# EAGLE design SupportESP8266 (EAGLE 7.5.0)
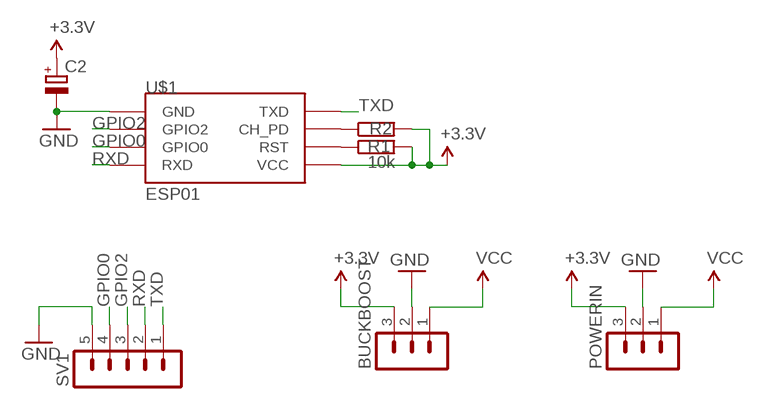
[diagram p0: schematic, sheet 1]

## Parts
BUCKBOOST  MA03-1  [MA03-1]
C2  CPOL-EUE5-10.5  [E5-10,5]
POWERIN  MA03-1  [MA03-1]
R1  10k  R-EU_0204/7  [0204/7]
R2  R-EU_0204/7  [0204/7]
SV1  MA05-1  [MA05-1]
U$1  ESP01  [ESP01]

## Nets
+3.3V [POWER]: BUCKBOOST.3 C2.+ POWERIN.3 R1.2 R2.2 U$1.VCC
+3V [POWER]: BUCKBOOST.1 POWERIN.1 ; supply symbol labelled VCC
GND [POWER]: BUCKBOOST.2 C2.- POWERIN.2 SV1.5 U$1.GND
GPIO0: SV1.4 U$1.GPIO0
GPIO2: SV1.3 U$1.GPIO2
N$1: R1.1 U$1.RST
N$2: R2.1 U$1.CH_PD
RXD: SV1.2 U$1.RX(RXD)
TXD: SV1.1 U$1.TX(TXD)

## Library data of the parts
BUCKBOOST POWERIN = con-lstb:MA03-1: PIN HEADER; OC_FARNELL: unknown; OC_NEWARK: unknown
C2 = rcl:CPOL-EU: POLARIZED CAPACITOR, European symbol
R1 R2 = rcl:R-EU_: RESISTOR, European symbol
SV1 = con-lstb:MA05-1: PIN HEADER; OC_FARNELL: unknown; OC_NEWARK: unknown
U$1 = esp8266modules:ESP01: ESP8266 Wifi module 01

## Net classes
0 default: width 0.305 mm, clearance 0.254 mm
1 POWER: width 0.508 mm, clearance 0.305 mm

## Board
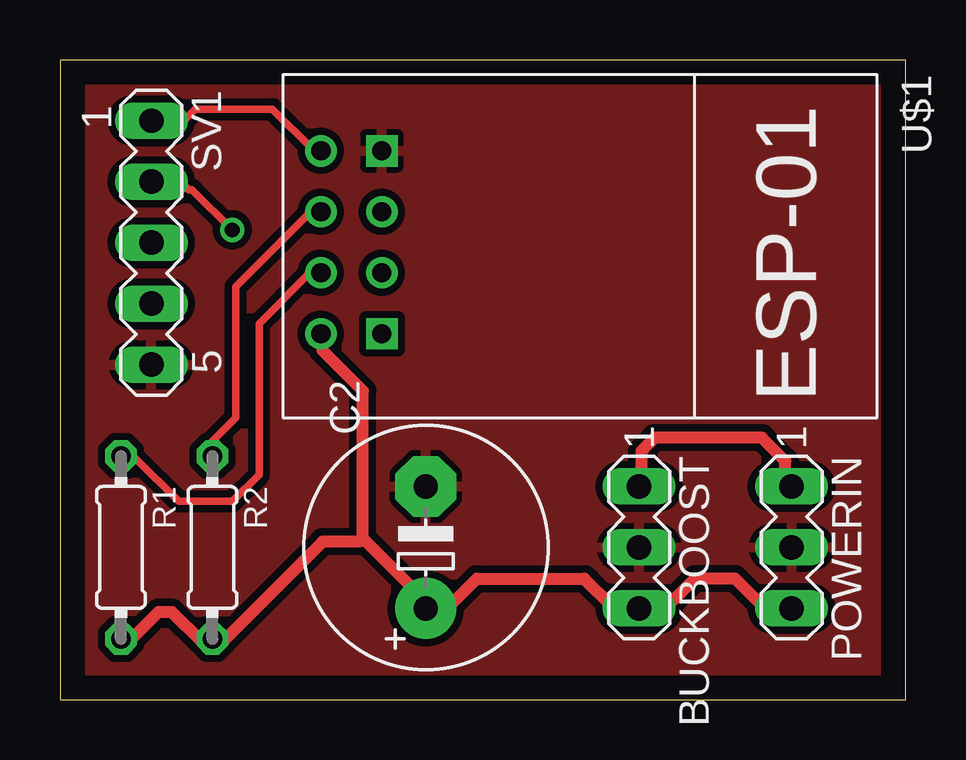
[diagram p1: board, top side]
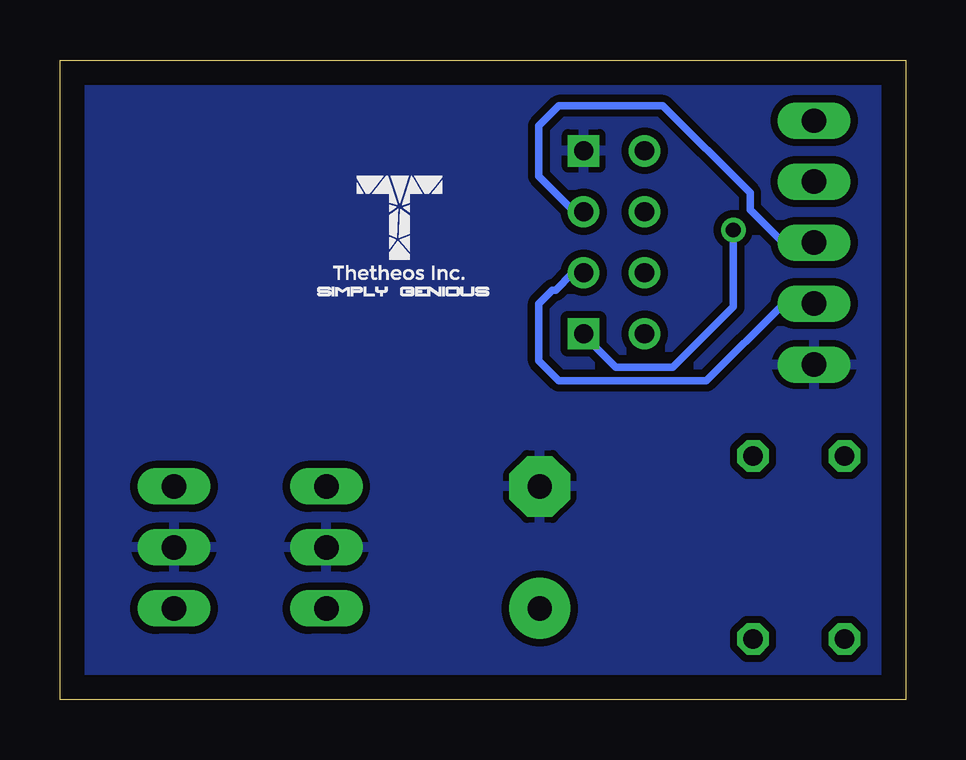
[diagram p2: board, bottom side, seen from below]

Size 35.23 x 26.66 mm. Coordinates in mm from the lower left corner, seen from the top.
Outline: 0,0 35.23,0 35.23,26.66 0,26.66 0,0
Copper layers (1*16): Top 0.035mm / dielectric 1.5mm / Bottom 0.035mm
Design rules "default": minimum track width 10mil, minimum drill 24mil, track to track 8mil, track to pad 8mil, pad to pad 8mil, via to via 8mil, smd to smd 8mil, copper to edge 40mil, drill to drill 8mil, minimum pad ring 10mil, minimum via ring 8mil, stop-mask expansion 4mil, vias tented up to drill 0mil, thermal gap 10mil

### Footprints (pad centres in the part's own frame; a part is rotated, then mirrored left to right if it is on the bottom)
MA03-1 = drill 1.016 long: 1 -2.54,0; 2 0,0; 3 2.54,0
E5-10,5 = drill 1.016 pad 2.54: + -2.54,0 | drill 1.016 pad 2.54 octagon: - 2.54,0
0204/7 = drill 0.813 octagon: 1 -3.81,0; 2 3.81,0
MA05-1 = drill 1.016 long: 1 -5.08,0; 2 -2.54,0; 3 0,0; 4 2.54,0; 5 5.08,0
ESP01 = drill 0.8: CH_PD -1.285,-8.178; GPIO0 1.255,-5.638; GPIO2 -1.285,-5.638; RST 1.255,-8.178; TX -3.825,-8.178; VCC 3.795,-8.178 | drill 0.8 square: GND -3.825,-5.638; RX 3.795,-5.638

### Placement (x,y rotation side)
BUCKBOOST  24.13,6.35 270 top
C2  15.24,6.35 90 top
POWERIN  30.48,6.35 270 top
R1  2.54,6.35 270 top
R2  6.35,6.35 270 top
SV1  3.81,19.05 270 top
U$1  19.05,19.05 270 top

### Tracks (layer width: path | path; a pad name or v marks a point on that pad's centre or on a via)
+3.3V
  Top 0.508: POWERIN.3 30.37,3.94 29.25,3.94 28.13,5.05 26.45,5.05 25.34,3.94 24.22,3.94 BUCKBOOST.3 23.94,3.94 22.96,3.94 21.84,5.05 17.37,5.05 16.26,3.94 15.42,3.94 C2.+ 15.14,3.94 15.14,4.22 12.62,6.73 | R1.2 2.98,2.54 4.1,3.66 4.66,3.66 5.92,2.4 6.2,2.4 6.34,2.54 R2.2 6.9,2.54 10.95,6.59 12.48,6.59 12.62,6.73 | 12.62,6.73 12.62,12.88 10.95,14.55 10.95,15.25 U$1.VCC
+3V
  Top 0.508: BUCKBOOST.1 24.22,8.97 24.22,10.36 24.78,10.92 29.25,10.92 30.23,9.94 30.23,9.11 30.37,8.97 POWERIN.1
GND
  pour Bottom: 0,26.67 0,0 35.56,0 35.56,26.67
  pour Top: 0,26.67 0,0 35.56,0 35.56,26.67
GPIO0
  Bottom 0.305: SV1.4 5.08,16.51 8.29,13.3 14.44,13.3 15.28,14.13 15.28,16.51 14.72,17.07 14.58,17.07 13.88,17.77 13.46,17.77 U$1.GPIO0
GPIO2
  Bottom 0.305: U$1.GPIO2 13.46,20.42 13.88,20.42 15.28,21.82 15.28,23.91 14.44,24.75 10.11,24.75 6.48,21.12 6.48,20.42 5.22,19.16 3.82,19.16 SV1.3
N$1
  Top 0.305: U$1.RST 10.81,17.77 10.39,17.77 8.29,15.67 8.29,9.38 7.17,8.27 4.94,8.27 3.12,10.08 2.56,10.08 R1.1
N$2
  Top 0.305: U$1.CH_PD 10.81,20.28 10.39,20.28 7.31,17.21 7.31,11.76 6.34,10.78 6.34,10.22 R2.1
RXD  (via drill 0.61)
  Top 0.305: v7.17,19.58 5.5,21.26 5.36,21.26 5.08,21.54 3.82,21.54 SV1.2
  Bottom 0.305: v7.17,19.58 7.17,16.37 9.69,13.86 12.06,13.86 13.04,14.83 13.04,14.97 13.32,15.25 U$1.RX
TXD
  Top 0.305: U$1.TX 10.81,22.94 10.53,22.94 8.85,24.61 5.64,24.61 5.22,24.19 3.82,24.19 SV1.1